# EAGLE design senior_project_rev4 (EAGLE 7.5.0)
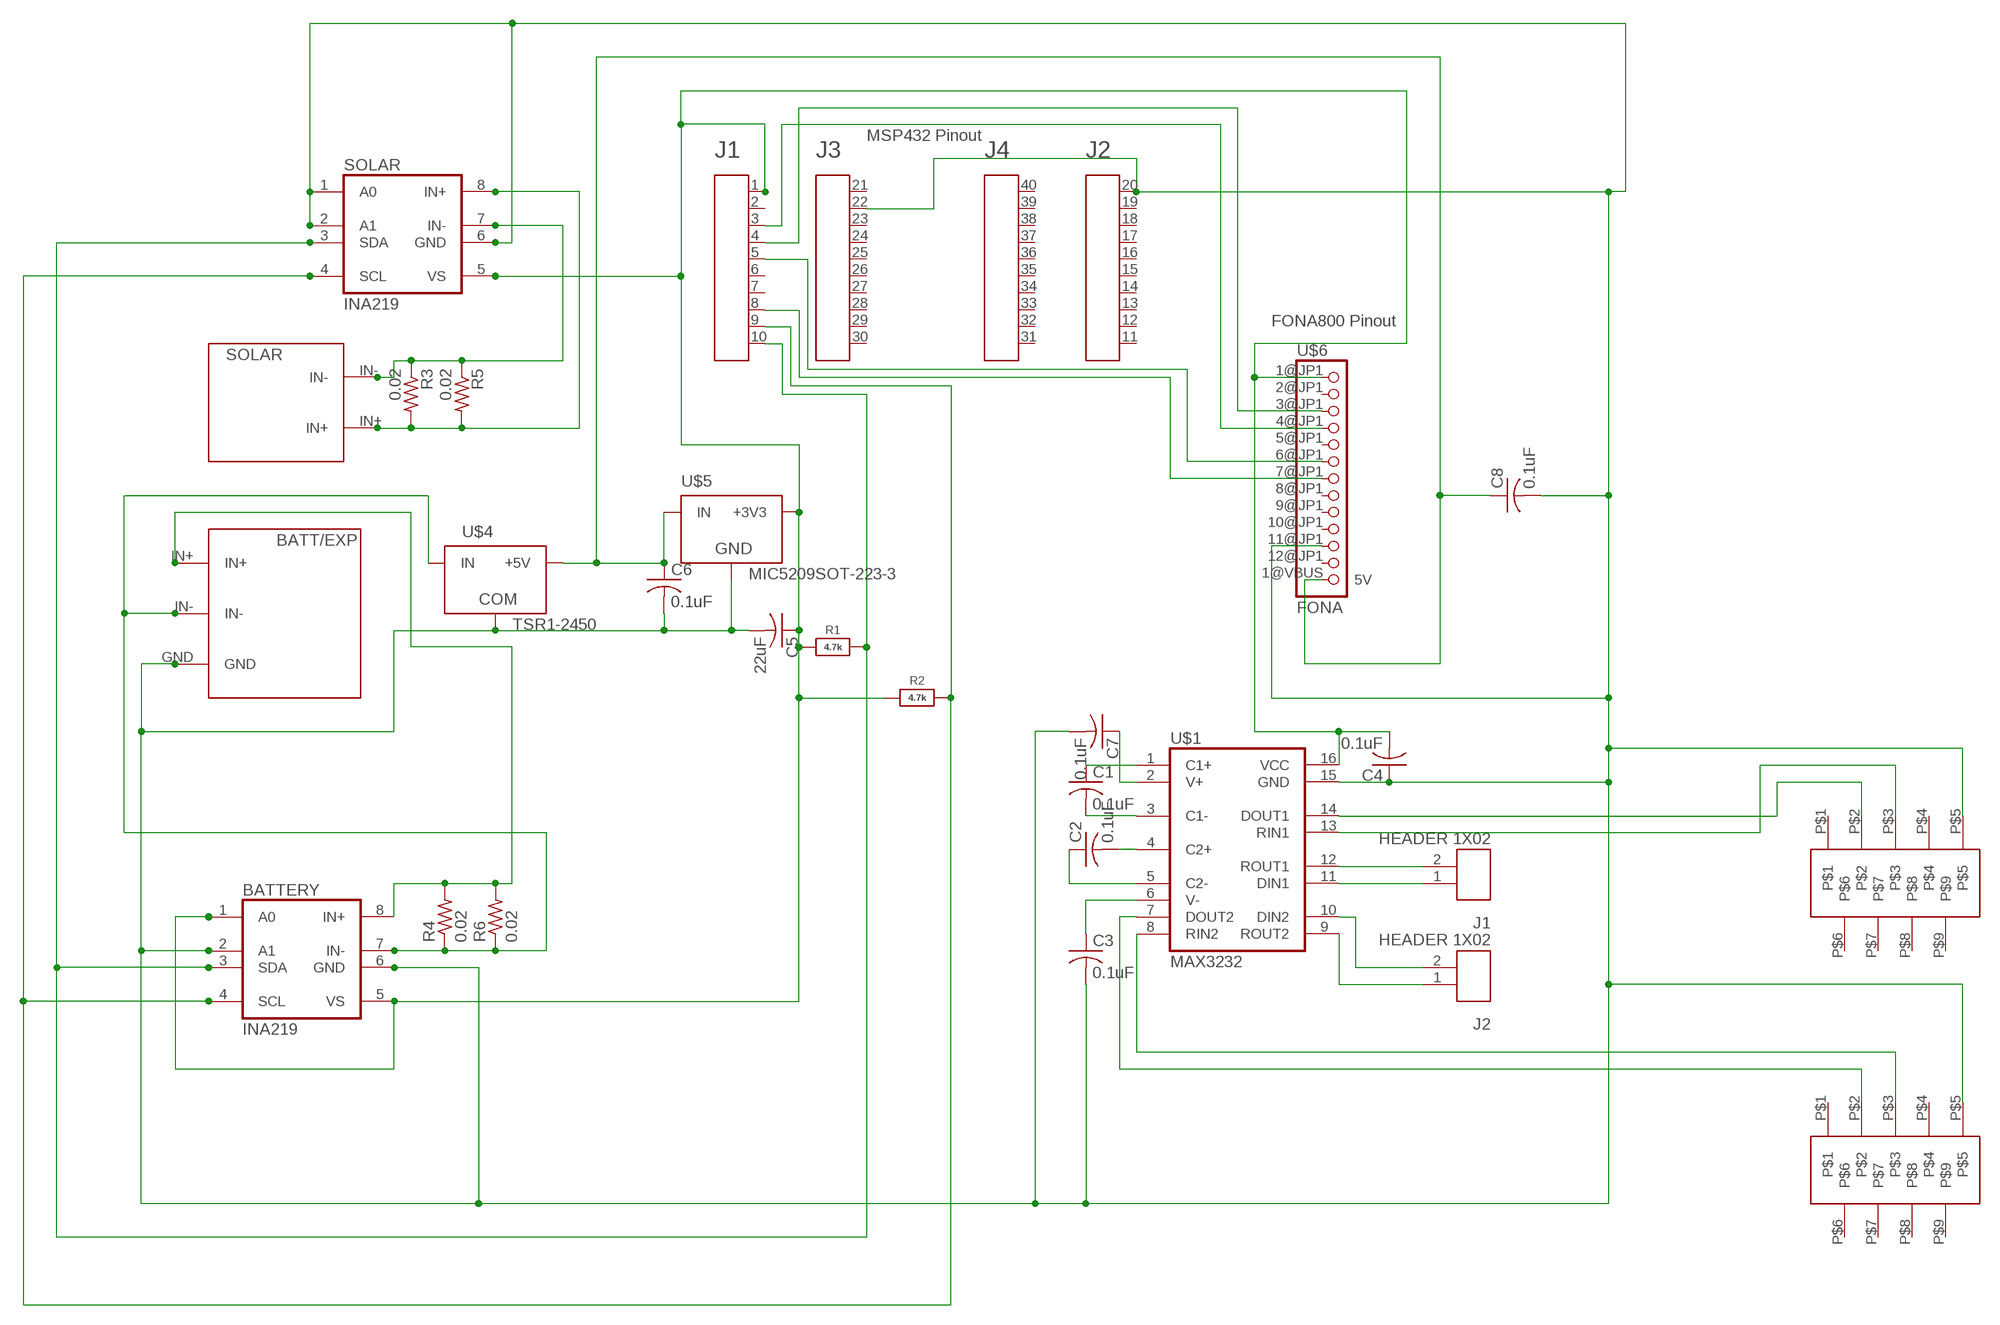
[diagram p0: schematic, sheet 1]

## Parts
A1  MSP432  HEADER4X10-BOOSTERPACK  [4X10-BOOSTERPACK]
BATTERY  INA219  [SO08]
C1  0.1uF  C-USC1206  [C1206]
C2  0.1uF  C-USC1206  [C1206]
C3  0.1uF  C-USC1206  [C1206]
C4  0.1uF  C-USC1206  [C1206]
C5  22uF  C-USC1206  [C1206]
C6  0.1uF  C-USC1206  [C1206]
C7  0.1uF  C-USC1206  [C1206]
C8  0.1uF  C-USC1206  [C1206]
J1  HEADER 1X02  HEADER1X02_100-TH  [1X02]
J2  HEADER 1X02  HEADER1X02_100-TH  [1X02]
R1  4.7k  RESISTOR_1206  [_1206]
R2  4.7k  RESISTOR_1206  [_1206]
R3  0.02  R-US_R2512  [R2512]
R4  0.02  R-US_R2512  [R2512]
R5  0.02  R-US_R2512  [R2512]
R6  0.02  R-US_R2512  [R2512]
RS232-1  XM2C-9  [XM2C]
RS232-2  XM2C-9  [XM2C]
SOLAR  INA219  [SO08]
U$1  MAX3232  [SO16]
U$2  TERM-3  [TERM-3]
U$3  TERM-2  [TERM-2]
U$4  TSR1-2450  [TSR-1]
U$5  MIC5209SOT-223-3  [SOT-223]
U$6  FONA  [JP1_ADAFRUIT-FONA-800-GSM-BREAKOUT]

## Nets
3.3V: A1.1 BATTERY.1(A0) BATTERY.5(VS) C4.2 C5.1 R1.1 R2.1 SOLAR.5(VS) U$1.16(VCC) U$5.3(+3V3) U$6.1@JP1(VIO)
5V: C6.1 C8.1 U$4.3(+5V) U$5.1(IN) U$6.1@VBUS(5V)
12V: BATTERY.7(IN-) R4.1 R6.1 U$2.IN- U$4.1(IN)
GND: A1.20 A1.22 BATTERY.2(A1) BATTERY.6(GND) C3.2 C4.1 C5.2 C6.2 C7.2 C8.2 RS232-1.P$5 RS232-2.P$5 SOLAR.1(A0) SOLAR.2(A1) SOLAR.6(GND) U$1.15(GND) U$2.GND U$4.2(COM) U$5.2(GND) U$5.4(GND) U$6.11@JP1(GND)
N$1: C3.1 U$1.6(V-)
N$4: RS232-2.P$2 U$1.7(DOUT2)
N$5: A1.8 U$6.7@JP1(PS)
N$6: R3.1 R5.1 SOLAR.7(IN-) U$3.IN-
N$7: R3.2 R5.2 SOLAR.8(IN+) U$3.IN+
N$9: J1.2 U$1.12(ROUT1)
N$10: A1.10 BATTERY.3(SDA) R1.2 SOLAR.3(SDA)
N$11: C1.2 U$1.3(C1-)
N$12: C1.1 U$1.1(C1+)
N$13: C2.2 U$1.4(C2+)
N$14: C2.1 U$1.5(C2-)
N$15: C7.1 U$1.2(V+)
N$16: RS232-1.P$2 U$1.14(DOUT1)
N$17: RS232-1.P$3 U$1.13(RIN1)
N$19: RS232-2.P$3 U$1.8(RIN2)
N$20: A1.9 BATTERY.4(SCL) R2.2 SOLAR.4(SCL)
N$21: A1.5 U$6.6@JP1(KEY)
N$23: A1.4 U$6.3@JP1(RX)
N$24: A1.3 U$6.4@JP1(TX)
N$25: J1.1 U$1.11(DIN1)
N$26: J2.2 U$1.10(DIN2)
N$27: J2.1 U$1.9(ROUT2)
N$30: BATTERY.8(IN+) R4.2 R6.2 U$2.IN+
Unconnected: A1.2 A1.6 A1.7 A1.11 A1.12 A1.13 A1.14 A1.15 A1.16 A1.17 A1.18 A1.19 A1.21 A1.23 A1.24 A1.25 A1.26 A1.27 A1.28 A1.29 A1.30 A1.31 A1.32 A1.33 A1.34 A1.35 A1.36 A1.37 A1.38 A1.39 A1.40 RS232-1.P$1 RS232-1.P$4 RS232-1.P$6 RS232-1.P$7 RS232-1.P$8 RS232-1.P$9 RS232-2.P$1 RS232-2.P$4 RS232-2.P$6 RS232-2.P$7 RS232-2.P$8 RS232-2.P$9 U$6.2@JP1(NS) U$6.5@JP1(RI) U$6.8@JP1(RST) U$6.9@JP1(SPRK-) U$6.10@JP1(SPKR+) U$6.12@JP1(BAT)

## Notes on the sheet
- MSP432 Pinout
- FONA800 Pinout
- SOLAR
- BATT/EXP

## Library data of the parts
A1 = EAGLE_BoosterPack_Library:HEADER4X10-BOOSTERPACK
BATTERY SOLAR = annuzzi:INA219
C1-C4 = resistor:C-US: CAPACITOR, American symbol
C5-C8 = Adafruit-FONA-800-GSM-Breakout:C-US: CAPACITOR, American symbol
J1 J2 = EAGLE_BoosterPack_Library:HEADER1X02_; CCO: 258-0001290; DESCRIPTION: CONN HEADER .100 SINGL STR 2POS; MAN: SULLINS
R1 R2 = Adafruit-FONA-800-GSM-Breakout:RESISTOR: Resistors For new designs, use the packages preceded by an '_' character since they are more reliable: The following footprints should be used on most boards: _0402 - Standard footprint for regular board layouts _0603 - Standard footprint for regular board layouts _0805 - Standard footprint for regular board layouts _1206 - Standard footprint for regular board layouts For extremely tight-pitch boards where space is at a premium, the following 'micro-pitch' footprints can be used (smaller pads, no silkscreen outline, etc.): _0402MP - Micro-pitch footprint for very dense/compact boards _0603MP - Micro-pitch footprint for very dense/compact boards _0805MP - Micro-pitch footprint for very dense/compact boards _1206MP - Micro-pitch footprint for very dense/compact boards
R3-R6 = resistor:R-US_: RESISTOR, American symbol
RS232-1 RS232-2 = annuzzi:XM2C-9
U$1 = annuzzi:MAX3232
U$2 = annuzzi:TERM-3
U$3 = annuzzi:TERM-2
U$4 = SteelCaveRobotics-Power:TSR1-2450: Traco Power TSR 1-2450 5.0v switching regulator
U$5 = SteelCaveRobotics-Power:MIC5209: MIC5209 3.3v LDO Linear Regulator
U$6 = adafruit2:FONA

## Board
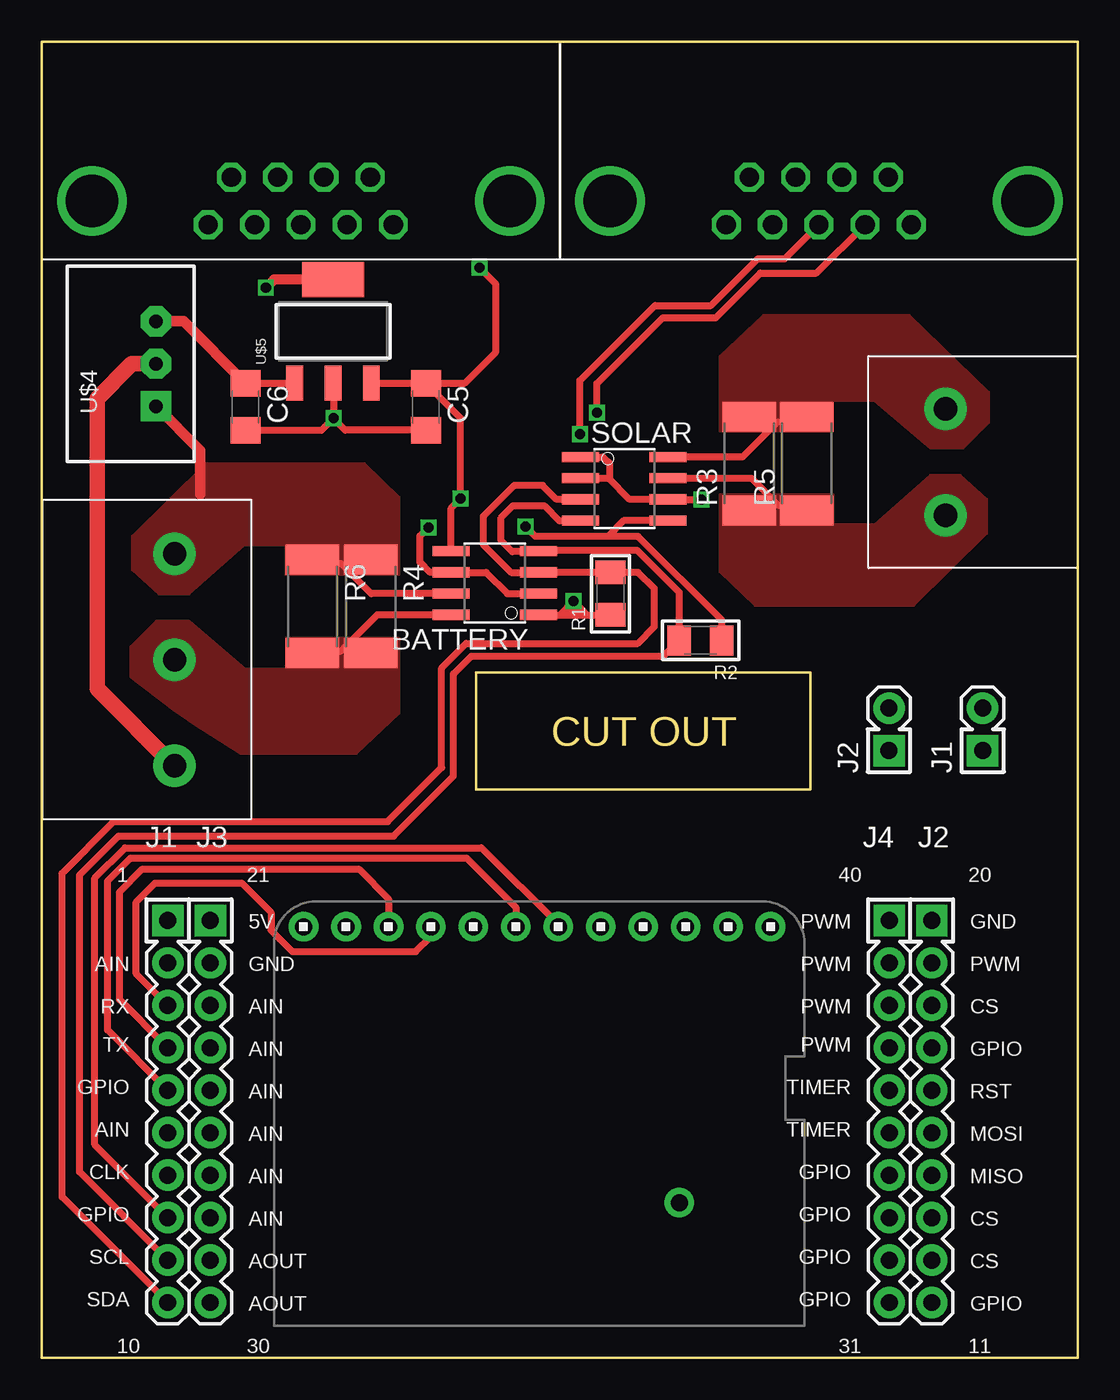
[diagram p1: board, top side]
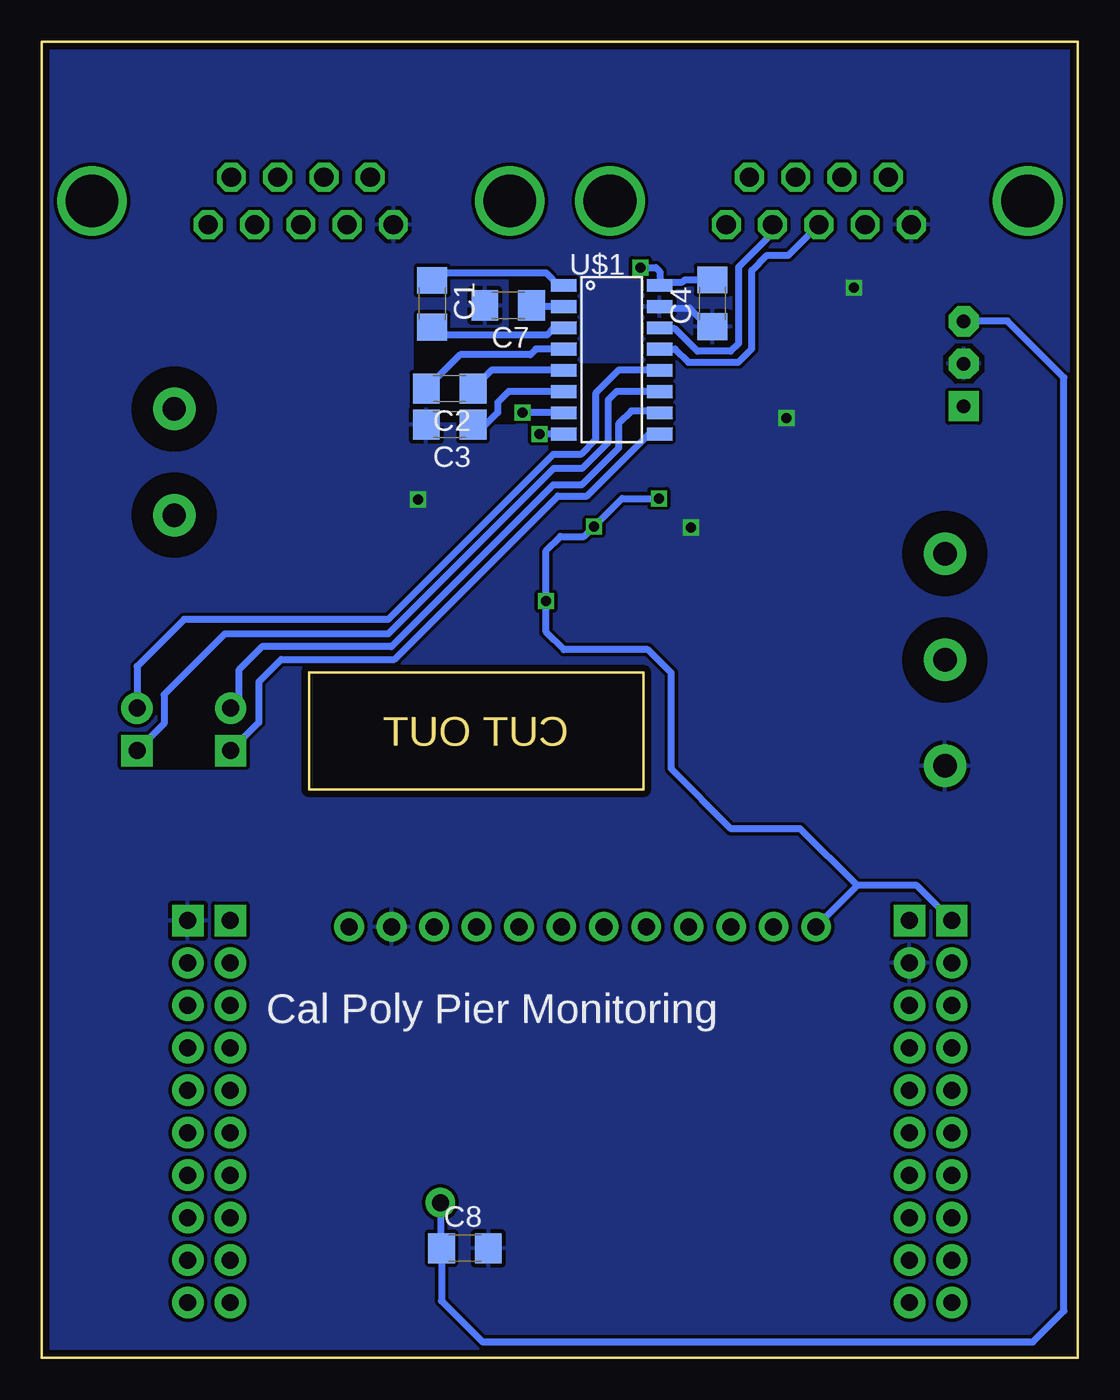
[diagram p2: board, bottom side, seen from below]

Size 62 x 78.74 mm. Coordinates in mm from the lower left corner, seen from the top.
Outline: 0,0 62,0 62,78.74 0,78.74 0,0
Outline: 26,34 26,41 46,41 46,34 26,34
Copper layers (1*16): Top 0.0356mm / dielectric 1.5011mm / Bottom 0.0356mm
Design rules "LaenPCBOrder *": minimum track width 6mil, minimum drill 13mil, track to track 8mil, track to pad 8mil, pad to pad 8mil, via to via 8mil, smd to smd 6mil, copper to edge 15mil, drill to drill 6mil, minimum pad ring 7mil, minimum via ring 7mil, stop-mask expansion 3mil, vias tented up to drill 0mil, thermal gap 10mil
bRestrict: area 5.7,58.3 to 8,60.6; area 33.8,55.9 to 34.8,56.3; area 37.2,56.1 to 38,56.1; area 39.1,59.1 to 39.7,60.8; area 33.8,61.6 to 34,64.5; area 51.7,35.3 to 55.3,35.4; area 31.4,54.4 to 31.6,54.7; area 27.6,59 to 29.8,59.4; area 5.9,46.1 to 10,50.1; area 5.9,39.7 to 10,43.8; area 52,54.7 to 56.1,58.8; area 52,48.4 to 56.1,52.5

### Footprints (pad centres in the part's own frame; a part is rotated, then mirrored left to right if it is on the bottom)
4X10-BOOSTERPACK = drill 1.016 pad 1.88 square: 1 0,10.16; 20 45.72,10.16; 21 2.54,10.16; 40 43.18,10.16 | drill 1.016 pad 1.88: 2 0,7.62; 3 0,5.08; 4 0,2.54; 5 0,0; 6 0,-2.54; 7 0,-5.08; 8 0,-7.62; 9 0,-10.16; 10 0,-12.7; 11 45.72,-12.7; 12 45.72,-10.16; 13 45.72,-7.62; 14 45.72,-5.08; 15 45.72,-2.54; 16 45.72,0; 17 45.72,2.54; 18 45.72,5.08; 19 45.72,7.62; 22 2.54,7.62; 23 2.54,5.08; 24 2.54,2.54; 25 2.54,0; 26 2.54,-2.54; 27 2.54,-5.08; 28 2.54,-7.62; 29 2.54,-10.16; 30 2.54,-12.7; 31 43.18,-12.7; 32 43.18,-10.16; 33 43.18,-7.62; 34 43.18,-5.08; 35 43.18,-2.54; 36 43.18,0; 37 43.18,2.54; 38 43.18,5.08; 39 43.18,7.62
SO08 = smd 0.61 x 2.21: 1 -1.905,-2.616; 2 -0.635,-2.616; 3 0.635,-2.616; 4 1.905,-2.616; 5 1.905,2.616; 6 0.635,2.616; 7 -0.635,2.616; 8 -1.905,2.616
C1206 = smd 1.6 x 1.8: 1 -1.4,0; 2 1.4,0
1X02 = drill 1.016 pad 1.88 square: 1 -1.27,0 | drill 1.016 pad 1.88: 2 1.27,0
_1206 = smd 1.4 x 1.8: 1 -1.27,0; 2 1.27,0
R2512 = smd 1.8 x 3.2: 1 -2.8,0; 2 2.8,0
XM2C = drill 3.15: CON1 3,-9.52; CON2 28,-9.52 | drill 1.15 octagon: P$1 21.04,-10.94; P$2 18.27,-10.94; P$3 15.5,-10.94; P$4 12.73,-10.94; P$5 9.96,-10.94; P$6 19.655,-8.1; P$7 16.885,-8.1; P$8 14.115,-8.1; P$9 11.345,-8.1
SO16 = smd 0.762 x 1.524: 1 -4.445,-2.875; 2 -3.175,-2.875; 3 -1.905,-2.875; 4 -0.635,-2.875; 5 0.635,-2.875; 6 1.905,-2.875; 7 3.175,-2.875; 8 4.445,-2.875; 9 4.445,2.875; 10 3.175,2.875; 11 1.905,2.875; 12 0.635,2.875; 13 -0.635,2.875; 14 -1.905,2.875; 15 -3.175,2.875; 16 -4.445,2.875
TERM-3 = drill 1.4 pad 2.54: GND 3.18,-7.9; IN+ 9.53,-7.9; IN- 15.88,-7.9
TERM-2 = drill 1.4 pad 2.54: IN+ 3.18,-7.9; IN- 9.53,-7.9
TSR-1 = drill 0.8 pad 1.8 square: 1 -2.54,-1.5 | drill 0.8 pad 1.8 octagon: 2 0,-1.5; 3 2.54,-1.5
SOT-223 = smd 1 x 2.1: 1 -2.3,-3.1; 2 0,-3.1; 3 2.3,-3.1 | smd 3.7 x 2.1: 4 0,3.1
JP1_ADAFRUIT-FONA-800-GSM-BREAKOUT = drill 1.016 pad 1.778: 1@JP1 29.972,1.524; 1@VBUS 7.493,18.034; 2@JP1 27.432,1.524; 3@JP1 24.892,1.524; 4@JP1 22.352,1.524; 5@JP1 19.812,1.524; 6@JP1 17.272,1.524; 7@JP1 14.732,1.524; 8@JP1 12.192,1.524; 9@JP1 9.652,1.524; 10@JP1 7.112,1.524; 11@JP1 4.572,1.524; 12@JP1 2.032,1.524

### Placement (x,y rotation side)
A1  7.54,16 0 top
BATTERY  27.11,46.36 90 top
C1  38.63,63.07 270 bottom
C2  37.59,57.99 180 bottom
C3  37.59,55.83 180 bottom
C4  21.87,63.09 90 bottom
C5  22.99,56.9 270 top
C6  12.19,56.9 270 top
C7  34.09,62.97 180 bottom
C8  36.68,6.55 0 bottom
J1  56.3,37.59 90 top
J2  50.7,37.59 90 top
R1  34.04,45.72 90 top
R2  39.42,42.93 180 top
R3  42.33,53.49 90 top
R4  19.69,44.96 270 top
R5  45.77,53.49 90 top
R6  16.21,44.96 270 top
RS232-1  0,78.74 0 top
RS232-2  31,78.74 0 top
SOLAR  34.86,51.99 270 top
U$1  27.9,59.72 270 bottom
U$2  0.05,32.23 90 top
U$3  61.98,59.94 270 top
U$4  5.33,59.47 90 top
U$5  17.43,61.42 0 top
U$6  45.64,27.31 180 top

### Tracks (layer width: path | path; a pad name or v marks a point on that pad's centre or on a via)
3.3V  (via drill 0.6)
  Top 0.406: U$5.3 22.97,58.32 | 22.97,58.32 C5.1 25.07,56.21 v25.07,51.41 24.5,50.84 BATTERY.5 | 32.03,45.06 v31.83,45.26 31.02,44.45 BATTERY.1 R1.1 32.64,44.45 32.03,45.06 | 32.03,45.06 31.62,44.68 32.21,44.83 | R2.1 40.69,44.15 35.69,49.15 33.88,49.15 | SOLAR.5 34.82,50.09 33.88,49.15 | 33.88,49.15 33.6,49.15 29.54,49.15 v28.96,49.73 | 22.97,58.32 25.32,58.32 27.18,60.17 27.18,64.24 v26.19,65.23
  Bottom 0.406: A1.1 9.62,28.25 13.21,28.25 | 13.21,28.25 U$6.1@JP1 | 13.21,28.25 16.61,31.65 20.75,31.65 24.33,35.23 24.33,40.97 25.73,42.37 30.76,42.37 31.83,43.43 v31.83,45.26 31.83,48.28 30.96,49.15 29.54,49.15 v28.96,49.73 27.28,51.41 v25.07,51.41 | C4.2 23.52,64.49 23.65,64.36 24.82,64.36 U$1.16 25.02,65 25.25,65.23 v26.19,65.23
5V
  Top 0.406: U$5.1 15.09,58.32 15.07,58.3 C6.1
  Top 0.635: C6.1 8.48,62.01 U$4.3
  Bottom 0.406: U$6.1@VBUS 38.15,6.62 C8.1 38.08,3.41 35.61,0.94 2.69,0.94 0.84,2.79 0.84,58.65 4.22,62.03 6.82,62.03 U$4.3
12V
  Top 0.406: BATTERY.7 19.71,45.72 17.88,47.55
  Top 0.635: U$4.1 9.47,54.29 9.47,51.66
  pour Top (isolate 0.508, no thermals): 21.39,46.86 21.39,51.49 19.3,53.49 9.8,53.49 5.41,49.17 5.41,47.12 7.01,45.69 8.81,45.69 12.14,48.64 14.61,48.64 14.61,46.86
GND  (via drill 0.6)
  Top 0.406: 33.93,52.6 35.18,51.36 SOLAR.6 v39.47,51.36 | 33.93,52.6 32.27,52.6 SOLAR.2 | BATTERY.2 27.86,45.72 26.59,46.99 BATTERY.6 23.24,46.99 22.63,47.6 22.63,49.17 v23.14,49.68 | SOLAR.1 33.58,53.9 33.96,53.52 33.96,52.63 33.93,52.6 | U$5.2 17.45,58.29 v17.45,56.21 | C6.2 16.74,55.5 v17.45,56.21 | C5.2 18.16,55.5 v17.45,56.21 | v39.47,51.36
  Top 0.61: U$5.4 13.89,64.52 v13.41,64.03
  Top 0.914: U$4.2 5.37,59.47 3.3,57.4 3.3,40.03 7.92,35.41 U$2.GND
  Bottom 0.406: U$1.15 24.95,62.81 23.24,62.81 22.12,61.69 C4.1 | v39.47,51.36 39.57,51.36
  pour Bottom (rank 2): 0,78.74 62,78.74 62,0 0,0
N$1
  Bottom 0.406: U$1.6 34.06,57.81 34.72,57.15 34.72,56.54 35.56,55.7 36.06,55.7 C3.1
N$4  (via drill 0.6)
  Top 0.406: v33.22,56.54 33.22,58.29 37.16,62.23 40.34,62.23 43,64.9 46.37,64.9 RS232-2.P$2
  Bottom 0.406: U$1.7 v33.22,56.54
N$5
  Top 0.406: A1.8 3.17,12.75 3.17,28.7 4.98,30.5 26.31,30.5 30.91,25.91 U$6.7@JP1
N$6
  Top 0.406: SOLAR.7 42.47,52.63 44.09,51
  pour Top (isolate 0.508, no thermals): 40.59,51.64 40.59,47.02 42.67,45.01 52.17,45.01 56.57,49.33 56.57,51.38 54.97,52.81 53.16,52.81 49.83,49.86 47.37,49.86 47.37,51.64
N$7
  Top 0.406: 44.04,56.01 41.94,53.9 SOLAR.8
  pour Top (isolate 0.508, no thermals): 40.59,55.45 40.59,59.94 43.18,62.38 51.92,62.38 56.67,57.78 56.67,55.96 55.14,54.43 53.16,54.43 49.81,57.28 47.35,57.28 47.35,55.45
N$9
  Bottom 0.406: U$1.12 27.48,59.08 28.85,57.71 28.85,54.94 29.74,54.05 31.39,54.05 41.27,44.17 53.49,44.17 56.3,41.36 J1.2
N$10
  Top 0.152: R1.2 34.13,46.99 34.14,46.99
  Top 0.406: A1.10 1.22,9.62 1.22,28.98 4.32,32.08 20.7,32.08 23.93,35.31 23.93,41.27 25.4,42.75 35.66,42.75 36.65,43.74 36.65,46.02 35.69,46.99 R1.2 | 34.41,46.99 34.14,46.99 BATTERY.3 28.09,46.99 26.42,48.67 26.42,50.34 28.27,52.2 29.97,52.2 30.81,51.36 SOLAR.3
N$11
  Bottom 0.406: C1.2 38.31,61.21 31.75,61.21 31.34,61.62 U$1.3
N$12
  Bottom 0.406: C1.1 38.05,64.92 31.83,64.92 31.07,64.16 U$1.1
N$13
  Bottom 0.406: U$1.4 32.44,60.35 32.77,60.02 36.96,60.02 C2.2
N$14
  Bottom 0.406: 36.02,57.81 C2.1 35.1,59.08 U$1.5
N$15
  Bottom 0.406: U$1.2 32.61,62.89 C7.1
N$16
  Bottom 0.406: RS232-1.P$2 18.27,67.3 20.3,65.28 20.3,60.71 20.78,60.22 22.76,60.22 24.11,61.57 24.97,61.57 U$1.14
N$17
  Bottom 0.406: U$1.13 24.11,60.35 23.32,59.56 20.32,59.56 19.51,60.38 19.51,65.05 18.59,65.96 17.34,65.96 RS232-1.P$3
N$19  (via drill 0.6)
  Top 0.406: v32.21,55.27 32.21,58.47 36.7,62.97 40.06,62.97 42.85,65.76 44.46,65.76 RS232-2.P$3
  Bottom 0.406: U$1.8 v32.21,55.27
N$20
  Top 0.406: 32.2,50.04 SOLAR.4 30.96,50.09 30.07,50.98 28.19,50.98 27.48,50.27 27.48,48.9 28.14,48.23 29.76,48.23 BATTERY.4 29.77,48.31 35.64,48.31 38.15,45.8 R2.2 37.21,41.99 25.7,41.99 24.64,40.92 24.64,34.8 21.06,31.22 4.6,31.22 2.26,28.88 2.26,11.12 A1.9
N$21
  Top 0.406: A1.5 3.94,19.61 3.94,28.52 5.31,29.9 25.43,29.9 28.37,26.95 U$6.6@JP1
N$23
  Top 0.406: A1.4 4.65,21.43 4.65,27.86 6.02,29.23 18.97,29.23 20.75,27.46 U$6.3@JP1
N$24
  Top 0.406: A1.3 5.66,22.96 5.66,27.28 6.78,28.4 11.96,28.4 13.72,26.64 13.72,25.58 14.99,24.31 22.38,24.31 23.29,25.22 U$6.4@JP1
N$25
  Bottom 0.406: U$1.11 27.61,57.81 28.12,57.3 28.12,54.76 29.67,53.21 31.37,53.21 41.27,43.31 51.05,43.31 54.69,39.67 54.69,37.94 J1.1
N$26
  Bottom 0.406: U$1.10 25.5,56.54 25.6,56.64 26.72,56.64 27.48,55.88 27.48,54.43 29.69,52.22 31.39,52.22 41.07,42.55 48.82,42.55 50.22,41.15 50.22,39.34 J2.2
N$27
  Bottom 0.406: J2.1 49.02,38 49.02,40.44 47.68,41.78 40.89,41.78 31.11,51.56 29.36,51.56 25.65,55.27 U$1.9
N$30
  Top 0.406: BATTERY.8 20.07,44.45 17.88,42.27
  pour Top (isolate 0.508, no thermals): 21.39,43.05 21.39,38.56 18.8,36.12 11.89,36.14 9.19,37.85 7.85,38.79 5.31,40.72 5.31,42.55 6.83,44.07 8.81,44.07 12.17,41.22 14.63,41.22 14.63,43.05

### Text on the board
Dimension: CUT OUT
bPlace: Cal Poly Pier Monitoring